# Altium schematic sheet V2.2.1.SchDoc
size 558 x 431 mm; SheetNumber: 1; SheetTotal: 1
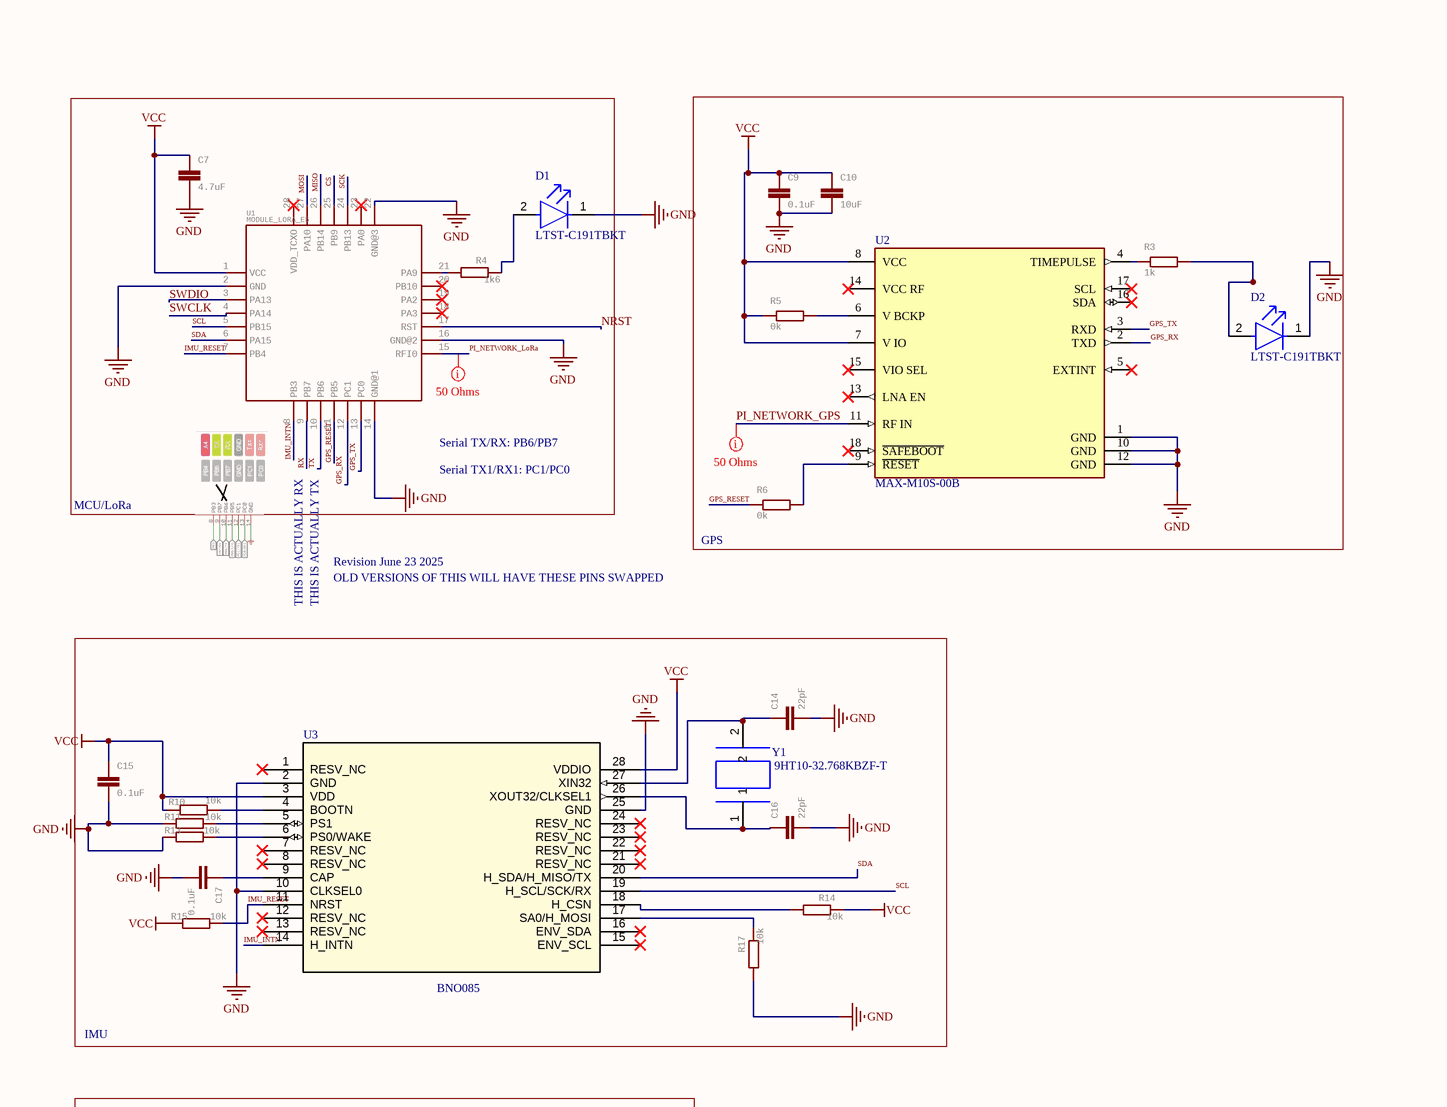
[diagram p0: V2.2.1.SchDoc, top left]
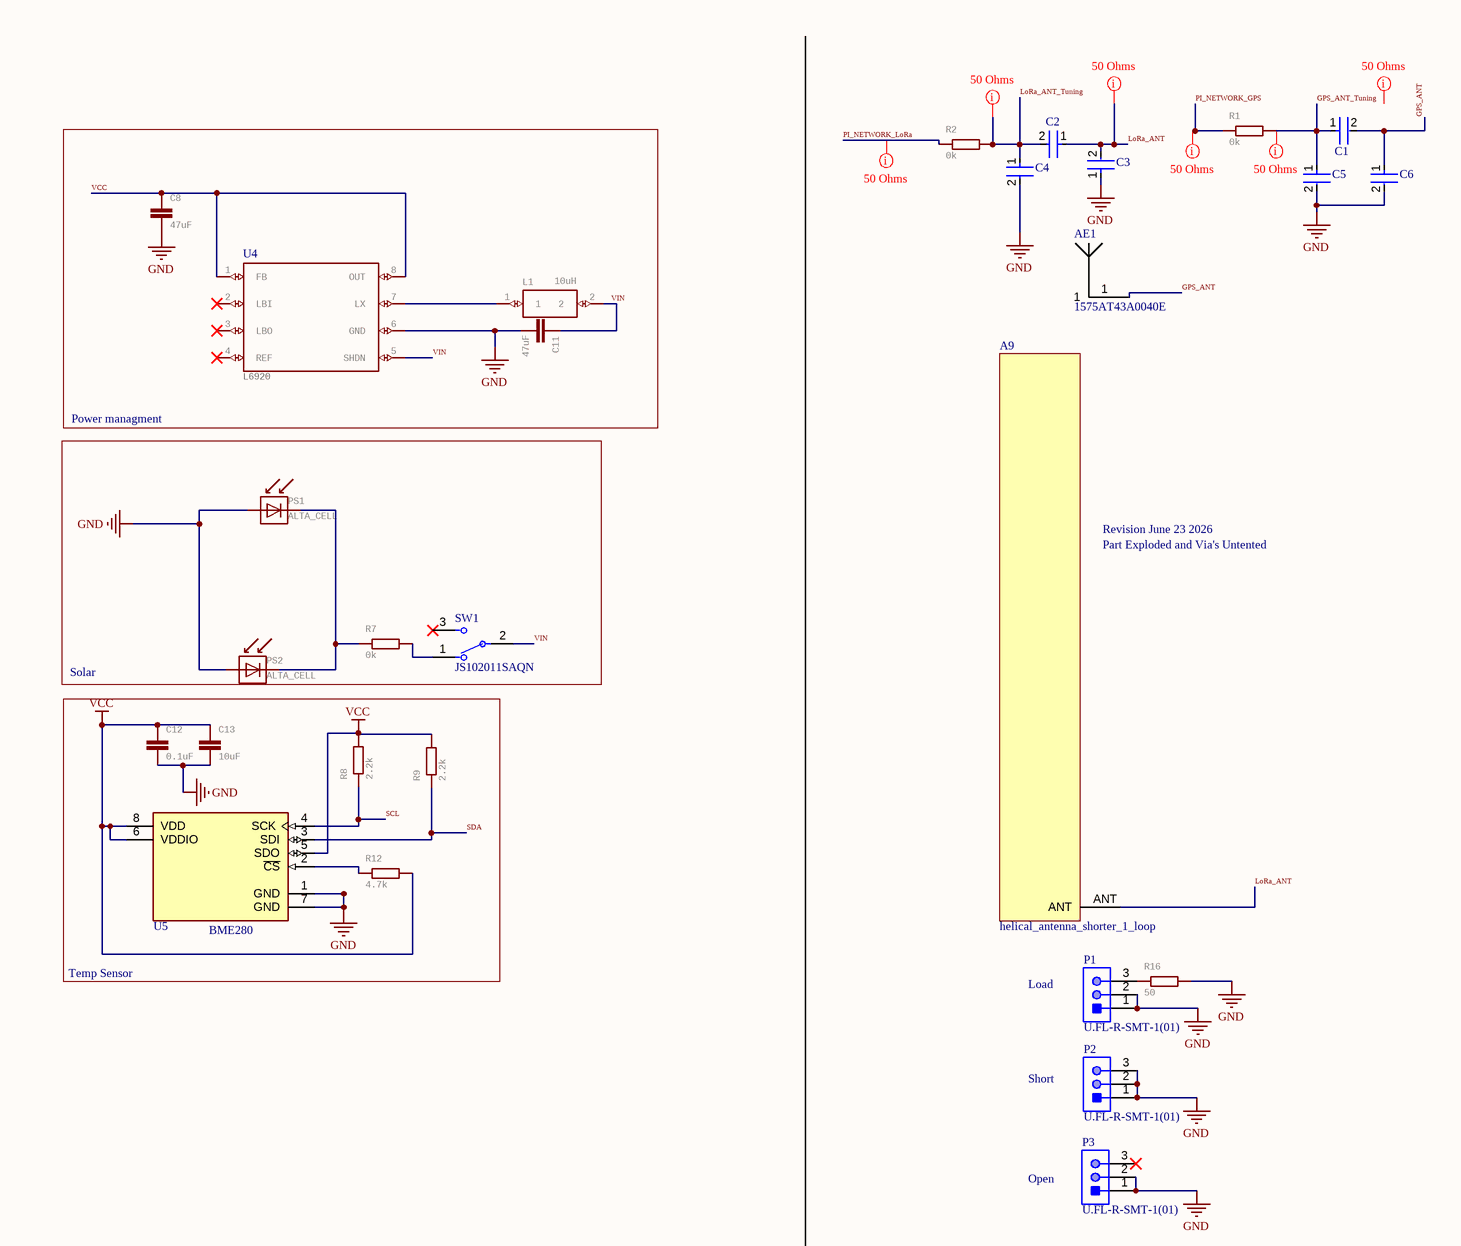
[diagram p1: V2.2.1.SchDoc, top right]
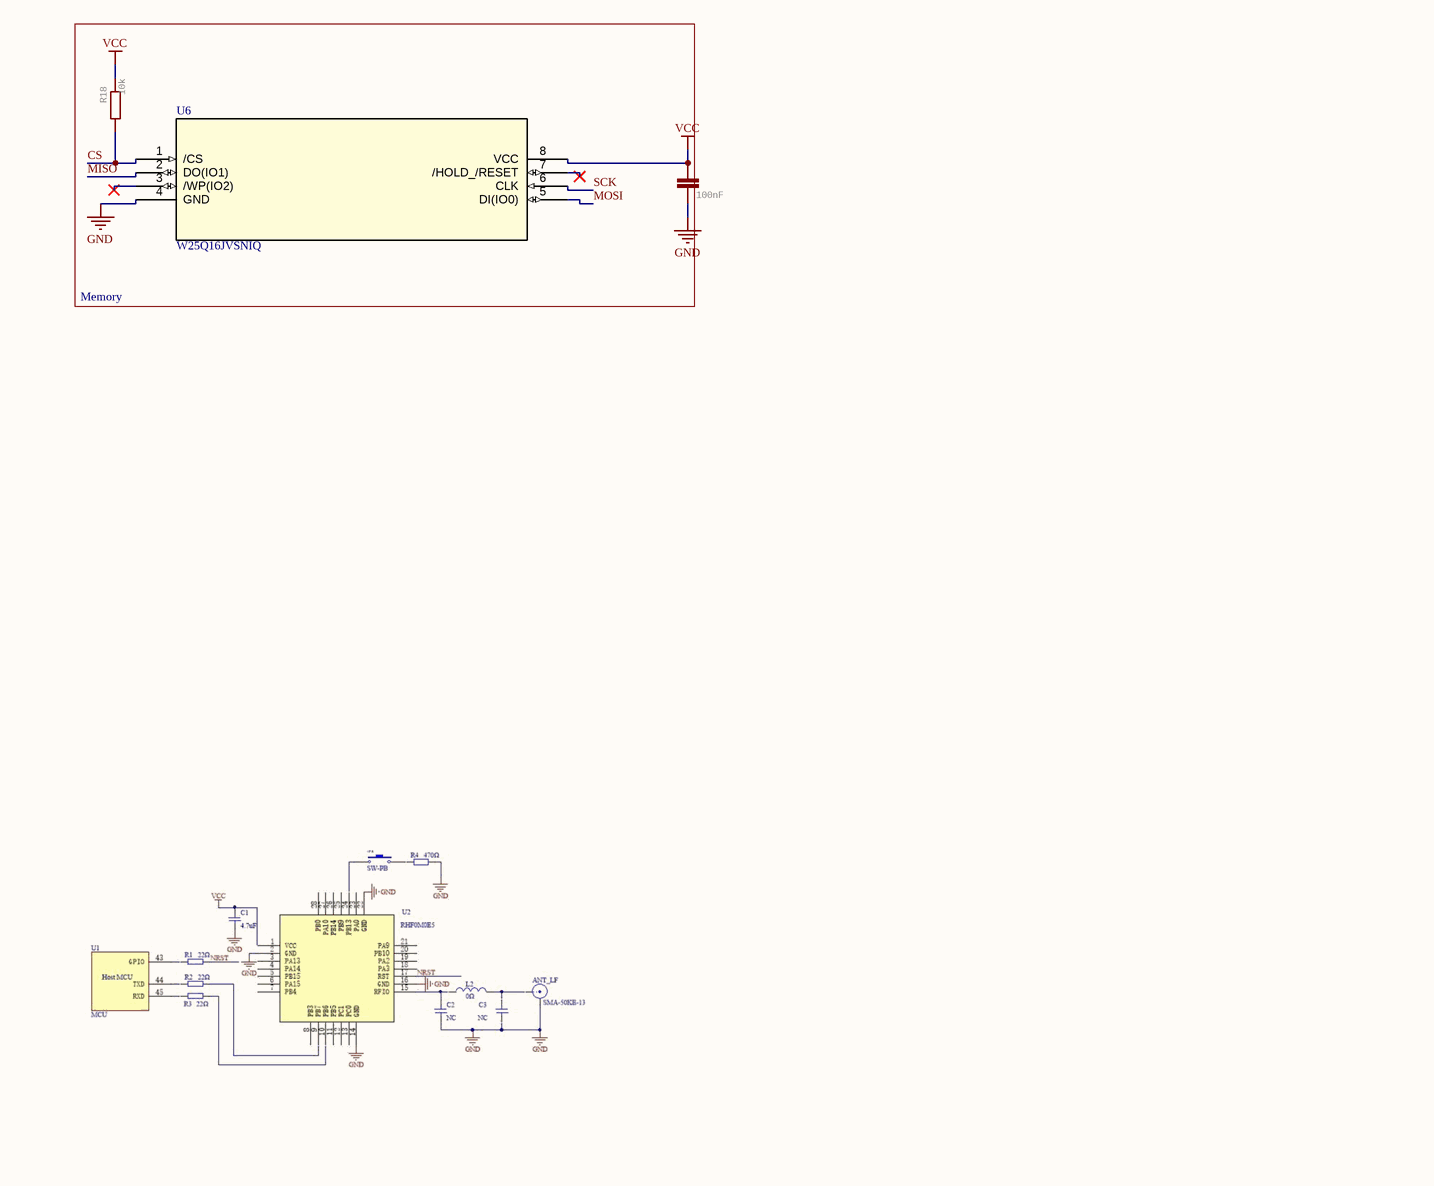
[diagram p2: V2.2.1.SchDoc, bottom left]
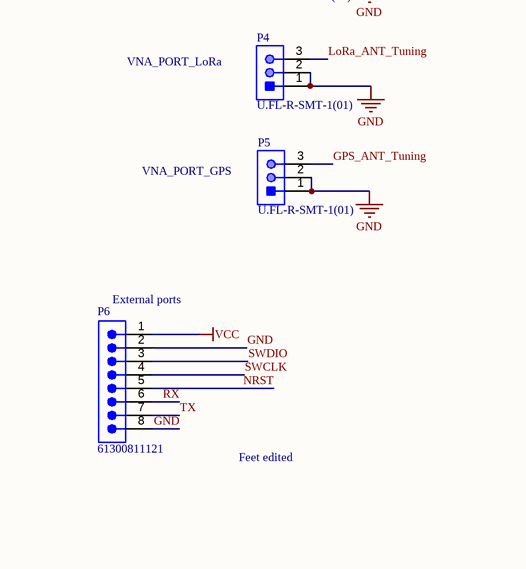
[diagram p3: V2.2.1.SchDoc, bottom right]

## Parts
A9  helical_antenna_shorter_1_loop  [LoRa_ANT_915_shorter_1_loop]
AE1  1575AT43A0040E  [ANT_1575AT_JOT-L]
C1  C0402C223K8PACTU  [PI_NET_CAPACITOR_0402]  (value not drawn)
C2  C0402C223K8PACTU  [PI_NET_CAPACITOR_0402]  (value not drawn)
C3  C0402C223K8PACTU  [PI_NET_CAPACITOR_0402]  (value not drawn)
C4  C0402C223K8PACTU  [PI_NET_CAPACITOR_0402]  (value not drawn)
C5  C0402C223K8PACTU  [PI_NET_CAPACITOR_0402]  (value not drawn)
C6  C0402C223K8PACTU  [PI_NET_CAPACITOR_0402]  (value not drawn)
C7  4.7uF  [0402]
C8  47uF  [RCL_M0805]
C9  0.1uF  [0402]
C10  10uF  [0402]
C11  47uF  [RCL_M0805]
C12  0.1uF  [0402]
C13  10uF  [0402]
C14  22pF  [0402]
C15  0.1uF  [0402]
C16  22pF  [0402]
C17  0.1uF  [0402]
C18  100nF  [0402]
D1  LTST-C191TBKT  [FP-LTST-C191TBKT-MFG]
D2  LTST-C191TBKT  [FP-LTST-C191TBKT-MFG]
L1  10uH  [ASPI-0315FS_ASPI-0315FS - The_real_one]
P1  U.FL-R-SMT-1(01)  [HRS-U.FL-R-SMT-3_V]
P2  U.FL-R-SMT-1(01)  [HRS-U.FL-R-SMT-3_V]
P3  U.FL-R-SMT-1(01)  [HRS-U.FL-R-SMT-3_V]
P4  U.FL-R-SMT-1(01)  [HRS-U.FL-R-SMT-3_V]
P5  U.FL-R-SMT-1(01)  [HRS-U.FL-R-SMT-3_V]
P6  61300811121  [8pinhead Slightly wider]
PS1  ALTA_CELL  [ALTA_CELL_SAME_SIZED_FEET_NO_SILK]
PS2  ALTA_CELL  [ALTA_CELL_SAME_SIZED_FEET_NO_SILK]
R1  0k  [0402]
R2  0k  [0402]
R3  1k  [0402]
R4  1k6  [0402]
R5  0k  [0402]
R6  0k  [0402]
R7  0k  [RCL_M0805]
R8  2.2k  [0402]
R9  2.2k  [0402]
R10  10k  [0402]
R11  10k  [0402]
R12  4.7k  [0402]
R13  10k  [0402]
R14  10k  [0402]
R15  10k  [0402]
R16  50  [0402]
R17  10k  [0402]
R18  10k  [0402]
SW1  JS102011SAQN  [FP-JS102011SAQN-MFG]
U1  MODULE_LORA_E5  [MODULE28P-1-25-12X12X2-5MM]
U2  MAX-M10S-00B  [FP-MAX-M10S-00B-MFG - duplicate]
U3  BNO085  [QFN28_BNO086_CEV]
U4  L6920  [L6920_L6920]
U5  d58e2f6669bc67e6a2bc6a28610ca79  [FP-BME280-MFG]  (value not drawn)
U6  W25Q16JVSNIQ  [SOIC_150MIL_WIN]
Y1  9HT10-32.768KBZF-T  [XTAL_9HT10_TXC]

## Blocks framed on the sheet
GPS: C9 C10 D2 R3 R5 R6 U2
Power managment: C8 C11 L1 U4
IMU: C14-C17 R10 R11 R13-R15 R17 U3 Y1
Memory: C18 R18 U6

## Nets
GND: C3.1 C4.2 C5.2 C6.2 C7.2 C8.2 C9.2 C10.2 C11.1 C12.2 C13.2 C14.2 C15.2 C16.2 C17.2 C18.2 D1.1(C) D2.1(C) P1.1 P1.2 P2.1 P2.2 P2.3 P3.1 P3.2 P4.1 P4.2 P5.1 P5.2 P6.2 P6.8 PS1.- PS2.- R11.2 R13.2 R16.2 R17.2 U1.2(GND) U1.14(GND@1) U1.16(GND@2) U1.22(GND@3) U2.1(GND) U2.10(GND) U2.12(GND) U3.2(GND) U3.10(CLKSEL0) U3.25(GND) U4.6(GND) U5.1(GND) U5.7(GND) U6.4(GND)
VCC: C7.1 C8.1 C9.1 C10.1 C12.1 C13.1 C15.1 C18.1 P6.1 R5.1 R8.2 R9.2 R10.2 R12.2 R14.1 R15.2 R18.1 U1.1(VCC) U2.7(V_IO) U2.8(VCC) U3.3(VDD) U3.28(VDDIO) U4.1(FB) U4.8(OUT) U5.5(SDO) U5.6(VDDIO) U5.8(VDD) U6.8(VCC)
CS: R18.2 U1.25(PB9) U6.1(/CS)
GPS_ANT: AE1.1 C1.2 C6.1
GPS_ANT_Tuning: C1.1 C5.1 P5.3 R1.2
GPS_RESET: R6.1 U1.11(PB5)
GPS_RX: U1.12(PC1) U2.2(TXD)
GPS_TX: U1.13(PC0) U2.3(RXD)
IMU_INTN: U1.8(PB3) U3.14(H_INTN)
IMU_RESET: R15.1 U1.7(PB4) U3.11(NRST)
LoRa_ANT: A9.ANT C2.1 C3.2
LoRa_ANT_Tuning: C2.2 C4.1 P4.3 R2.2
MISO: U1.26(PB14) U6.2(DO(IO1))
MOSI: U1.27(PA10) U6.5(DI(IO0))
NRST: P6.5 U1.17(RST)
PI_NETWORK_GPS: R1.1 U2.11(RF_IN)
PI_NETWORK_LoRa: R2.1 U1.15(RFI0)
RX: P6.6 U1.9(PB7)
SCK: U1.24(PB13) U6.6(CLK)
SCL: R8.1 U1.5(PB15) U3.19(H_SCL/SCK/RX) U5.4(SCK)
SDA: R9.1 U1.6(PA15) U3.20(H_SDA/H_MISO/TX) U5.3(SDI)
SWCLK: P6.4 U1.4(PA14)
SWDIO: P6.3 U1.3(PA13)
TX: P6.7 U1.10(PB6)
VIN: C11.2 L1.2 SW1.2(C) U4.5(SHDN)
NetC14_1: C14.1 U3.27(XIN32) Y1.2
NetC16_1: C16.1 U3.26(XOUT32/CLKSEL1) Y1.1
NetC17_1: C17.1 U3.9(CAP)
NetD1_2: D1.2(A) R4.1
NetD2_2: D2.2(A) R3.2
NetL1_1: L1.1 U4.7(LX)
NetP1_3: P1.3 R16.1
NetPS1_+: PS1.+ PS2.+ R7.1
NetR3_1: R3.1 U2.4(TIMEPULSE)
NetR4_2: R4.2 U1.21(PA9)
NetR5_2: R5.2 U2.6(V_BCKP)
NetR6_2: R6.2 U2.9(~{RESET})
NetR7_2: R7.2 SW1.1
NetR10_1: R10.1 U3.4(BOOTN)
NetR11_1: R11.1 U3.5(PS1)
NetR12_1: R12.1 U5.2(~{CS})
NetR13_1: R13.1 U3.6(PS0/WAKE)
NetR14_2: R14.2 U3.18(H_CSN)
NetR17_1: R17.1 U3.17(SA0/H_MOSI)

Not connected (* = marked no-connect by the designer): P3 3*; SW1 3*; U1 18(PA3)* 19(PA2)* 20(PB10)* 23(PA0)* 28(VDD_TCXO)*; U2 5(EXTINT)* 13(LNA_EN)* 14(VCC_RF)* 15(VIO_SEL)* 16(SDA)* 17(SCL)* 18(~{SAFEBOOT})*; U3 1(RESV_NC)* 7(RESV_NC)* 8(RESV_NC)* 12(RESV_NC)* 13(RESV_NC)* 15(ENV_SCL)* 16(ENV_SDA)* 21(RESV_NC)* 22(RESV_NC)* 23(RESV_NC)* 24(RESV_NC)*; U4 2(LBI)* 3(LBO)* 4(REF)*; U6 3(/WP(IO2))* 7(/HOLD_/RESET)*

## Layout directives
rule Impedance Constraint [Min = 49.00    Max = 51.00    ]: (no net found under the mark), GPS_ANT_Tuning, LoRa_ANT, LoRa_ANT_Tuning, PI_NETWORK_GPS, PI_NETWORK_LoRa

## Notes on the sheet
- (near U1) Serial TX/RX: PB6/PB7
- MCU/LoRa
- Serial TX1/RX1: PC1/PC0
- Revision June 23 2026
- Part Exploded and Via's Untented
- OLD VERSIONS OF THIS WILL HAVE THESE PINS SWAPPED
- Revision June 23 2025
- THIS IS ACTUALLY RX
- THIS IS ACTUALLY TX
- Solar
- (near U5) BME280
- Temp Sensor
- Load
- (near P2) Short
- Open
- VNA_PORT_LoRa
- VNA_PORT_GPS
- (near P6) External ports
- Feet edited
- DWG. NO.
- REV.
- SHT.
- REVISION
- DESCRIPTION
- DATE
- APPROVED
- THIS DOCUMENT AND THE DATA DISCLOSED HEREIN OR HEREWITH IS THE PROPERTY OF ALTIUM LIMITED AND MAY BE FREELY DISTRIBUTED IN WHOLE. NO RIGHTS ARE RESERVED OR EXPRESS OR IMPLIED WARANTEE GIVEN.
- ENG:
- DSN:
- APPROVALS
- PROJECT
- DOCUMENT REVISION:
- DESIGN ITEM:
- CHK:
- BOM:
- REFERENCE DOCUMENTS
- PROJECT REVISION:
- TITLE
- FAB DWG:
- PCB DWG:
- ASSY DWG:
- SCALE:
- SIZE
- C
- CAGE CODE
- FILE NAME
- DWG NO.
- SHEET
- OF
- REV

## Library data of the parts
A9 = helical_antenna_shorter_1_loop: helical_antenna schematic for the DeSCENT v1 ChipSat
AE1 = 1575AT43A0040E: No Description Available; Mfr_Name: Johanson Technology; Digi-Key_Part_Number_3: 712-1003-6-ND; Digi-Key_Part_Number_2: 712-1003-1-ND; Digi-Key_Part_Number_1: 712-1003-2-ND
C1-C6 = 0402RFCapacitor_NO_SILK: CAP CER 0.022UF 10V X5R 0402; Manufacturer: Kemet; Capacitance: 22,000 pF; Value: 22,000 pF; Temperature Coefficient: 15%; Material: Ceramic; Tolerance: 0.1; RoHS: TRUE; Octopart: https://octopart.com/c0402c223k8pactu-kemet-140074; Category: Cap; Manufacturer Part Number: C0402C223K8PACTU; Lead Free: Yes; Automotive: No; Height: 0.55mm; Ipc Land Pattern Name: CAPC10050X50; ComponentLink2URL: https://content.kemet.com/datasheets/KEM_C1002_X7R_SMD.pdf; Device Class L2: Capacitors; Temperature Range Low: -55°C; ComponentLink2Description: Datasheet; Mouser Description: Multilayer Ceramic Capacitors MLCC - SMD/SMT 10volts 22000pF X5R 10%; Voltage Rating: 10 V; Device Class L3: Ceramic Capacitors; Package: C0402-BB; Digikey Description: CAP CER 0.022UF 10V X5R 0402; Temperature Characteristic: X5R; Temperature: -55°C to +125°C; Device Class L1: Passive Components; Temperature Range High: +125°C
C7-C17 = C-EUC0805K: CAPACITOR, European symbol; GateName_1: G$1; SymbolName_1: C-EU; DeviceName: C0805K; LibraryName: rcl; DeviceSetName: C-EU
C18 = RCL_C-EUC0805: GateName_1: G$1; DeviceName: C0805; SymbolName_1: RCL_C-EU; LibraryName: AmbaSat-1v1-01-NO-solar; DeviceSetName: RCL_C-EU; Package: RCL_C0805
D1 D2 = CMP-22017-000008-1: LED BLUE CLEAR CHIP SMD; Lens Color: Colorless; Dominant Wavelength: 475nm; Forward Current: 20mA; Wavelength: 468nm; Viewing Angle: 130°; Power Dissipation: 76mW; Luminous Intensity: 180mcd; Reverse Voltage: 5V; Number of Elements: 1; Lens Style: Diffused; Forward Voltage: 3.8V; Max Power Dissipation: 75mW; Case Code (Metric): 1608; Packaging: Tape and Reel; Case/Package: 0603; Depth: 1.6mm; Mount: Surface Mount; Lead Free: Lead Free; Min Operating Temperature: -20°C; Lens Transparency: Clear; Illumination Color: Blue; Height: 0.55mm; Test Current: 20mA; Case Code (Imperial): 0603; Max Operating Temperature: 80°C; Number of Pins: 2; Length: 0.8mm; Radiation Hardening: No; Package Quantity: 1; Number of LEDs: 1; Width: 0.8mm; Color: Blue
L1 = ASPI-0315FS: GateName_1: G$1; SymbolName_1: ASPI-0315FS; LibraryName: ASPI-0315FS; DeviceSetName: ASPI-0315FS
P1-P5 = CN-1P-M-R3: Ultra Small Coaxial Connector, 6 GHz, -40 to 90 degC, 3-Pin SMD, RoHS, Bulk; Manufacturer: Hirose Electric; Connector Style: U.FL; Impedance: 50Ohm; Dielectric Material: LiquidCrystalPolymer(LCP); Minimum Quantity: UltraMiniatureCoaxial; Online Catalog: U.FLSeries; Featured Product: HiroseU.FLSeries; Frequency - Max: 6GHz; Other Names: H122041 / U.FL-R-SMT-1(01)-ND; Contact Termination: Solder; Body Material: PhosphorBronze; Connector Type: Jack,MalePin; Body Finish: Silver; Center Contact Plating: Gold; Manufacturer URL: https://www.hirose.com; Family: CoaxialConnectors(RF); Fastening Type: Snap-On; Unit PriceUSD: U.FL; Series: U.FL; Package Reference: U.FL-R-SMT; Packaging: Bulk; Standard Package: 100; Mounting Type: SurfaceMount; Quantity Available: Bulk; Housing Color: Silver; Package Description: 3-Pin Surface Mount Device, Body 2.6 x 2.6 mm; Category: Connectors,Interconnects; Operating Temperature: -40degC~90degC; Center Contact Material: PhosphorBronze; Dynamic Catalog: U.FLSeries; Datasheet URL: https://datasheet.ciiva.com/26945/getdatasheetpartid-475239-26945414.pdf; Datasheet Version: Feb-09; Shield Termination: Solder
P6 = 8pinhead: NexarPartId: 32855533; Connector Type: Male Pin; Number of Contacts: 8; Voltage Rating: 250V; Current Rating: 3A; Contact Resistance: 20mΩ; Pitch: 2.54mm; Gender: Male; Termination: Solder; Contact Material: Copper; Mount: Through Hole; Lead Pitch: 2.54mm; Number of Positions: 8; Operating Supply Voltage: 250V; Number of Pins: 8; Max Operating Temperature: 105°C; Height: 8.54mm; REACH SVHC: Unknown; Number of Rows: 1; Packaging: Bulk; Contact Plating: Gold; Contact Mating Length: 5.9944mm; Orientation: Vertical; RoHS: Compliant; Color: Black; Min Operating Temperature: -40°C
PS1 PS2 = ALTA_CELL_RESIZED_NO_SILK: No SILK; GateName_1: G$1; SymbolName_1: ALTA_CELL; LibraryName: ALTA_CELL; DeviceSetName: ALTA_CELL
R1 R2 = R-EU_M0805: GateName_1: G$1; SymbolName_1: R-EU; DeviceName: M0805; DeviceSetName: R-EU_; LibraryName: rcl
R3-R6 R8-R18 = R-EU_M0805: RESISTOR, European symbol; GateName_1: G$1; SymbolName_1: R-EU; DeviceName: M0805; DeviceSetName: R-EU_; LibraryName: rcl
R7 = R-EU_M0805: Larger Resistor for Solar; GateName_1: G$1; SymbolName_1: R-EU; DeviceName: M0805; DeviceSetName: R-EU_; LibraryName: rcl
SW1 = CMP-2000-06501-2: SWITCH SLIDE SPDT 300MA 6V; Switch Function: On-On; Illumination Type: Non-Illuminated; Switch Travel: 2mm; Contact Resistance: 70mR; Actuator Material: Nylon; Electrical Life: 5000Cycles; Actuator Type: Standard; Max Operating Temperature: 85°C; Housing Material: Nylon; Radiation Hardening: No; Max Voltage Rating (DC): 6V; Package Quantity: 1; Case/Package: 100; Actuator Length: 2mm; Min Operating Temperature: -40°C; Contact Current Rating: 300mA; REACH SVHC: No SVHC; Throw Configuration: SPDT; Packaging: Tape and Reel; Contact Material: Copper Alloy; Max Current Rating: 300mA; Current Rating: 300mA; Mount: Surface Mount; Lead Free: Lead Free; Termination: Gull Wing; Voltage Rating (DC): 6V; Length: 9mm; Orientation: Right Angle; Contact Plating: Silver
U1 = MODULE_LORA_E5: GateName_1: G$1; SymbolName_1: MOUDLE_LORA_E5; LibraryName: LORA-E5_Eagle_Library; DeviceSetName: MODULE_LORA_E5; Package: MODULE28P-1.25-12X12X2.5MM
U2 = CMP-207130-000026-1: GNSS LCC RX, ROM, TCXO, LNA, SAW
U3 = BNO086: No Description Available; Mfr_Name: CEVA; Type: Motion Sensors; RefDes: RefDes
U4 = L6920: Voltage stepper upper L6920DTR model; GateName_1: G$1; SymbolName_1: L6920; LibraryName: L6920; DeviceSetName: L6920
U5 = d58e2f6669bc67e6a2bc6a28610ca79: Temp and huminity sensor
U6 = W25Q16JVSNIQ: No Description Available; Mfr_Name: Winbond; RefDes: RefDes; Type: Type
Y1 = 9HT10-32.768KBZF-T: Crystal, 32.768khz, 12.5pf, 3.2 x 1.5mm; Package: None; Price: None; Value: *; MP: 9HT10-32.768KBZF-T; Availability: Unavailable